# EasyEDA schematic schematic_rack-monitor.json
TITLE: rack-monitor; REV: 1.1; Date: 2026-08-21; Sheet: 1/1; Drawn By: Daniel; Company: .
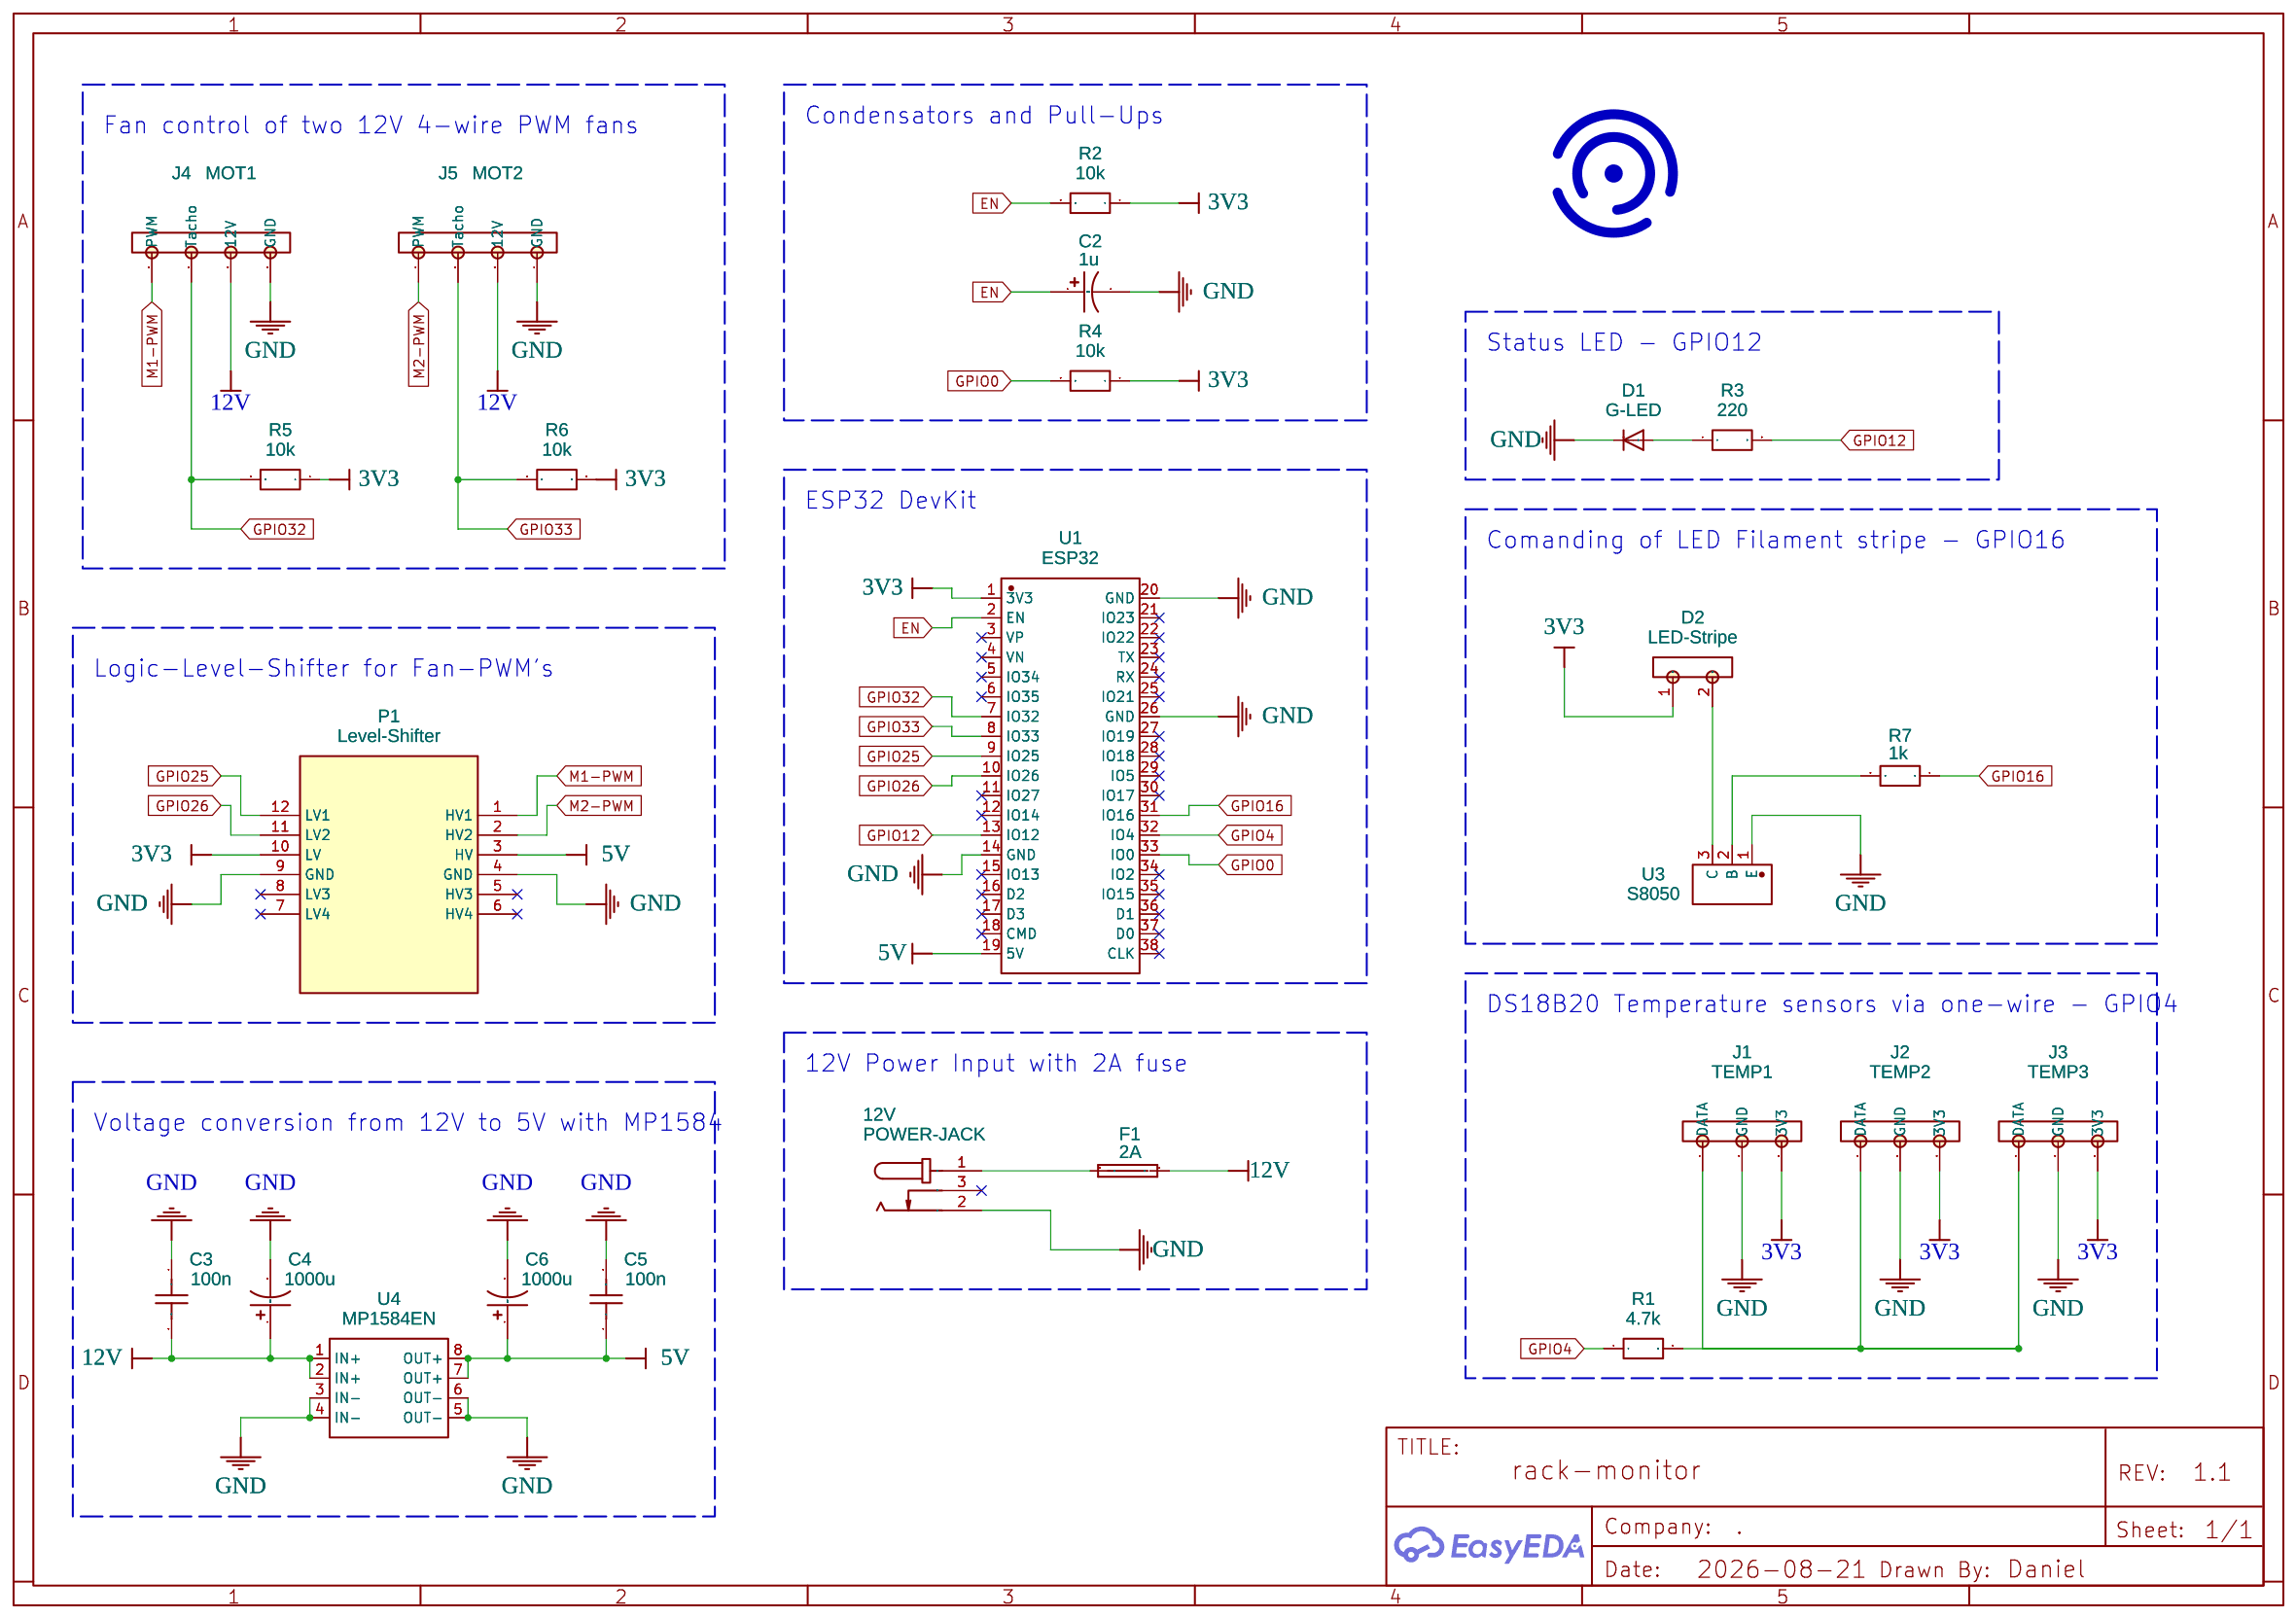
[diagram p0: schematic sheet]

## Parts
12V  POWER-JACK  [DC_12V_POWER-JACK]
C2  1u  [ELKO-D5-2.00MM]
C3  100n  [CERAMICCAPACITOR_5.5MM]
C4  1000u  [ELKO-D10-5.08MM]
C5  100n  [CERAMICCAPACITOR_5.5MM]
C6  1000u  [ELKO-D10-5.08MM]
D1  G-LED  [CON1X2]
D2  LED-Stripe  [CON1X2]
F1  2A  [FUSE-HOLDER-WITH-COVER-FOR-5X20MM-FUSE_FOOTPRINT]
J1  TEMP1  [CON1X03]
J2  TEMP2  [CON1X03]
J3  TEMP3  [CON1X03]
J4  MOT1  [CON1X04]
J5  MOT2  [CON1X04]
P1  Level-Shifter  [LOGIC_LEVEL BIDIRECTIONAL]
R1  4.7k  [R_AXIAL-0.3-9.9MM]
R2  10k  [R_AXIAL-0.3-9.9MM]
R3  220  [R_AXIAL-0.3-9.9MM]
R4  10k  [R_AXIAL-0.3-9.9MM]
R5  10k  [R_AXIAL-0.3-9.9MM]
R6  10k  [R_AXIAL-0.3-9.9MM]
R7  1k  [R_AXIAL-0.3-9.9MM]
U1  ESP32  [ESP32-DEVKIT-38PIN]
U3  S8050  [TO-92-3_L4.6-W3.6-P1.27-L]
U4  MP1584EN  [PWRM-TH_MP1584EN_MOUDLE]

## Library data of the parts
12V = POWER-JACK: Contributor: LCSC; Supplier: LCSC; Supplier Part: C9900001795; Manufacturer: 索峰; JLCPCB Part Class: Extended Part
C2 C4 C6 = C_Tan_SMD_A_US: Contributor: LCEDA_Lib
C3 C5 = C_0603_US: Contributor: LCEDA_Lib
D1 = DIODE: Contributor: SparkFun
D2 = CON1X02 COPY: Contributor: KiCad
F1 = FUSE HOLDER WITH COVER FOR 5X20MM FUSE: Contributor: akshatamore2505
J1-J3 = CON1X03: Contributor: KiCad
J4 J5 = CON1X04: Contributor: KiCad
P1 = Logic_Level Bidirectional: sourceId: ldJDwO6oi
R1-R7 = R_0603_EU: Contributor: LCEDA_Lib
U1 = ESP32-DEVKITC-VE: Supplier: LCSC; Supplier Part: C20437001; Manufacturer: ESPRESSIF(乐鑫); JLCPCB Part Class: Extended Part; Contributor: lcsc
U3 = SS8050D331: Supplier: LCSC; Supplier Part: C22751467; Manufacturer: ALJ(龙晶微); JLCPCB Part Class: Extended Part; Contributor: lcsc
U4 = MP1584EN_MOUDLE: Supplier: LCSC; Supplier Part: C9900223542; Manufacturer: null; Manufacturer Part: MP1584EN_moudle; Contributor: lcsc

## Nets
3V3: D2.1(3V) J1.3(3V3) J2.3(3V3) J3.3(3V3) P1.10(LV) R2.1 R4.1 R5.1 R6.2 U1.1(3V3)
5V: C5.1 C6.1 P1.3(HV) U1.19(5V) U4.7(OUT+) U4.8(OUT+)
12V: C3.2 C4.1 F1.2 J4.3(12V) J5.3(12V) U4.1(IN+) U4.2(IN+)
GND: 12V.2 C2.2 C3.1 C4.2 C5.2 C6.2 D1.2 J1.2(GND) J2.2(GND) J3.2(GND) J4.4(GND) J5.4(GND) P1.4(GND) P1.9(GND) U1.14(GND) U1.20(GND) U1.26(GND) U3.1(E) U4.3(IN-) U4.4(IN-) U4.5(OUT-) U4.6(OUT-)
EN: C2.1 R2.2 U1.2(EN)
GPIO0: R4.2 U1.33(IO0)
GPIO4: R1.1 U1.32(IO4)
GPIO12: R3.2 U1.13(IO12)
GPIO16: R7.1 U1.31(IO16)
GPIO25: P1.12(LV1) U1.9(IO25)
GPIO26: P1.11(LV2) U1.10(IO26)
GPIO32: J4.2(Tacho) R5.2 U1.7(IO32)
GPIO33: J5.2(Tacho) R6.1 U1.8(IO33)
M1-PWM: J4.1(PWM) P1.1(HV1)
M2-PWM: J5.1(PWM) P1.2(HV2)
Net-(12V-1): 12V.1 F1.1
Net-(D1-1): D1.1 R3.1
Net-(D2-2): D2.2(GND) U3.3(C)
Net-(J1-1): J1.1(DATA) J2.1(DATA) J3.1(DATA) R1.2
Net-(R7-2): R7.2 U3.2(B)

Not connected (* = marked no-connect by the designer): 12V 3*; P1 5(HV3)* 6(HV4)* 7(LV4)* 8(LV3)*; U1 3(VP)* 4(VN)* 5(IO34)* 6(IO35)* 11(IO27)* 12(IO14)* 15(IO13)* 16(D2)* 17(D3)* 18(CMD)* 21(IO23)* 22(IO22)* 23(TX)* 24(RX)* 25(IO21)* 27(IO19)* 28(IO18)* 29(IO5)* 30(IO17)* 34(IO2)* 35(IO15)* 36(D1)* 37(D0)* 38(CLK)*

## Notes on the sheet
- Fan control of two 12V 4-wire PWM fans
- Condensators and Pull-Ups
- Status LED - GPIO12
- ESP32 DevKit
- Comanding of LED Filament stripe - GPIO16
- Logic-Level-Shifter for Fan-PWM's
- DS18B20 Temperature sensors via one-wire - GPIO4
- 12V Power Input with 2A fuse
- Voltage conversion from 12V to 5V with MP1584
